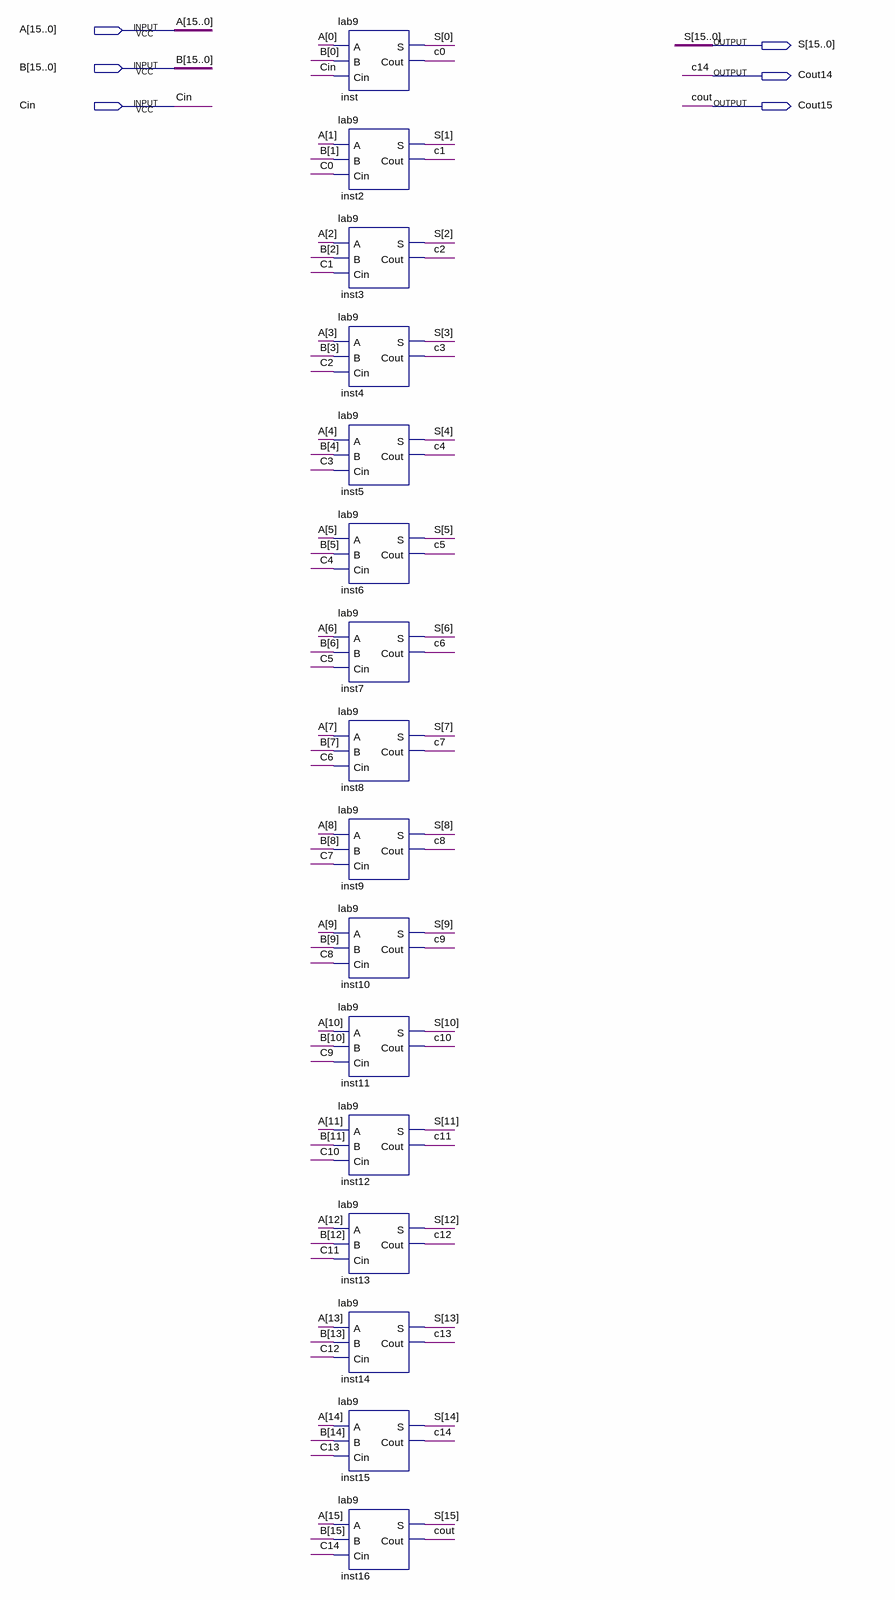
[diagram p0: schematic sheet]
// Quartus schematic FA.bdf as structural Verilog: 16 symbols, 6 pins
module FA (
  input  [15:0] A,
  input  [15:0] B,
  input  Cin,
  output [15:0] S,
  output Cout14,
  output Cout15
);

  wire c0, c1, c2, c3, c4, c5, c6, c7, c8, c9, c10, c11, c12, c13;

  lab9 inst (.A(A[0]), .B(B[0]), .Cin(Cin), .S(S[0]), .Cout(c0));
  lab9 inst2 (.A(A[1]), .B(B[1]), .Cin(c0), .S(S[1]), .Cout(c1));
  lab9 inst3 (.A(A[2]), .B(B[2]), .Cin(c1), .S(S[2]), .Cout(c2));
  lab9 inst4 (.A(A[3]), .B(B[3]), .Cin(c2), .S(S[3]), .Cout(c3));
  lab9 inst5 (.A(A[4]), .B(B[4]), .Cin(c3), .S(S[4]), .Cout(c4));
  lab9 inst6 (.A(A[5]), .B(B[5]), .Cin(c4), .S(S[5]), .Cout(c5));
  lab9 inst7 (.A(A[6]), .B(B[6]), .Cin(c5), .S(S[6]), .Cout(c6));
  lab9 inst8 (.A(A[7]), .B(B[7]), .Cin(c6), .S(S[7]), .Cout(c7));
  lab9 inst9 (.A(A[8]), .B(B[8]), .Cin(c7), .S(S[8]), .Cout(c8));
  lab9 inst10 (.A(A[9]), .B(B[9]), .Cin(c8), .S(S[9]), .Cout(c9));
  lab9 inst11 (.A(A[10]), .B(B[10]), .Cin(c9), .S(S[10]), .Cout(c10));
  lab9 inst12 (.A(A[11]), .B(B[11]), .Cin(c10), .S(S[11]), .Cout(c11));
  lab9 inst13 (.A(A[12]), .B(B[12]), .Cin(c11), .S(S[12]), .Cout(c12));
  lab9 inst14 (.A(A[13]), .B(B[13]), .Cin(c12), .S(S[13]), .Cout(c13));
  lab9 inst15 (.A(A[14]), .B(B[14]), .Cin(c13), .S(S[14]), .Cout(Cout14));
  lab9 inst16 (.A(A[15]), .B(B[15]), .Cin(Cout14), .S(S[15]), .Cout(Cout15));

  // Other names for the same wires on the sheet: c14 = Cout14; cout = Cout15
endmodule
